# Altium schematic sheet motherboard2.SchDoc
size A
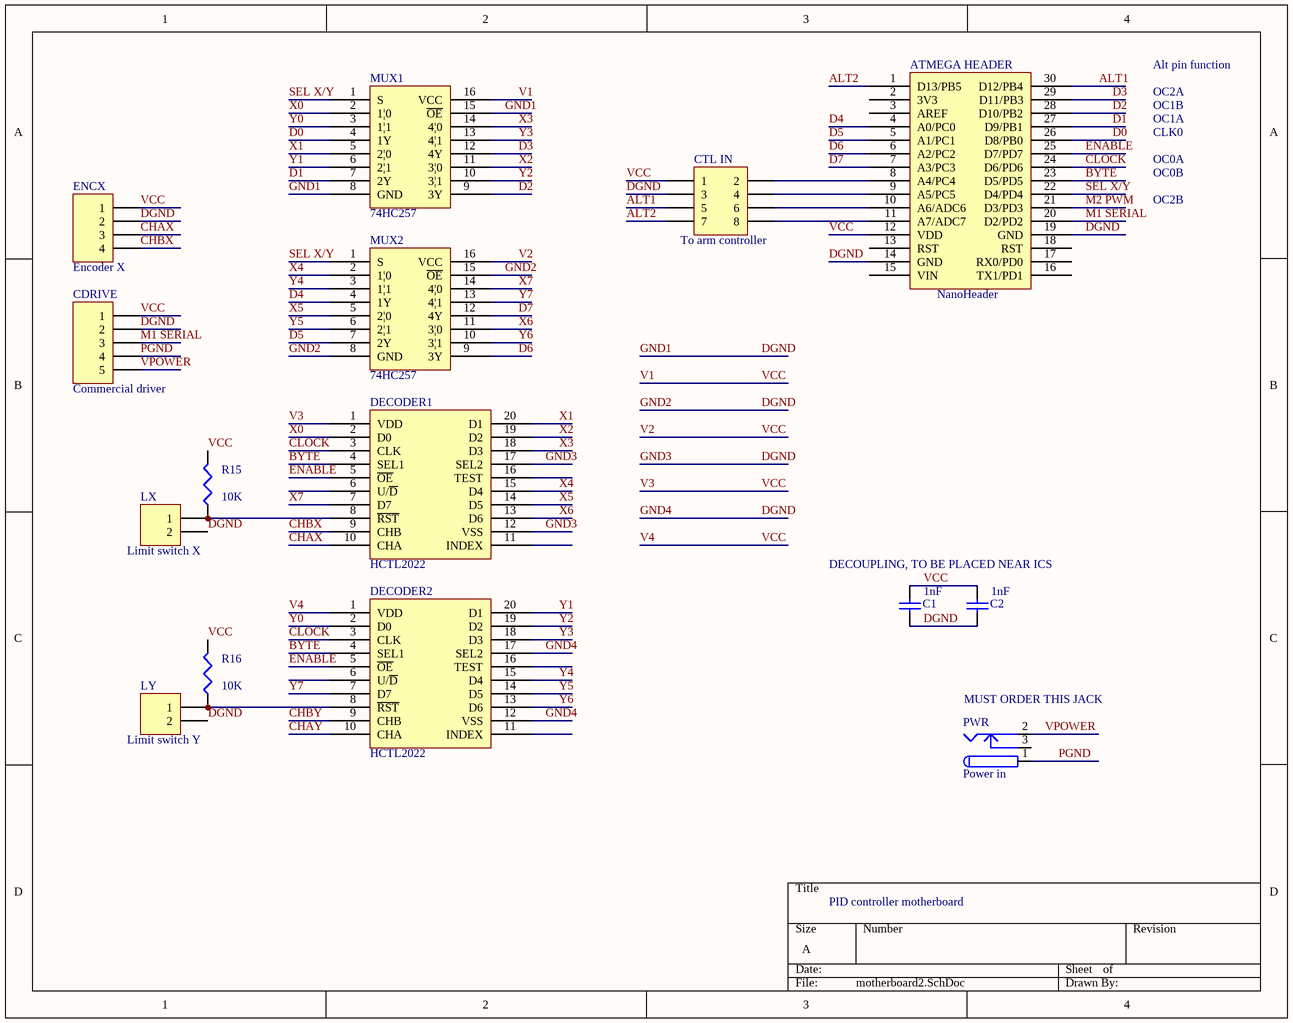
[diagram p0: motherboard2.SchDoc]

## Parts
ATMEGA_HEADER  NanoHeader  [DIP30W]
C1  value 1nF  [RAD-0.3]
C2  value 1nF  [RAD-0.3]
CDRIVE  Commercial driver  [HDR1X5_LGE1.0]
CTL_IN  To arm controller  [HDR2X4_LGE1.0]
DECODER1  HCTL2022  [N020D_LGE1.0]
DECODER2  HCTL2022  [N020D_LGE1.0]
ENCX  Encoder X  [HDR1X4_LGE1.0]
LX  Limit switch X  [HDR1X2_LGE1.0]
LY  Limit switch Y  [HDR1X2_LGE1.0]
MUX1  74HC257  [DIP16_LGE1.0]
MUX2  74HC257  [DIP16_LGE1.0]
PWR  Power in  [KLD_XLGE1.2]
R15  value 10K  [Res10mm_LGE1.0]
R16  value 10K  [Res10mm_LGE1.0]

## Nets
ALT1: ATMEGA_HEADER.30(D12/PB4) CTL_IN.5
ALT2: ATMEGA_HEADER.1(D13/PB5) CTL_IN.7
BYTE: ATMEGA_HEADER.23(D5/PD5) DECODER1.4(SEL1) DECODER2.4(SEL1)
CHAX: DECODER1.10(CHA) ENCX.3
CHAY: DECODER2.10(CHA)
CHBX: DECODER1.9(CHB) ENCX.4
CHBY: DECODER2.9(CHB)
CLOCK: ATMEGA_HEADER.24(D6/PD6) DECODER1.3(CLK) DECODER2.3(CLK)
D0: ATMEGA_HEADER.26(D8/PB0) MUX1.4(1Y)
D1: ATMEGA_HEADER.27(D9/PB1) MUX1.7(2Y)
D2: ATMEGA_HEADER.28(D10/PB2) MUX1.9(3Y)
D3: ATMEGA_HEADER.29(D11/PB3) MUX1.12(4Y)
D4: ATMEGA_HEADER.4(A0/PC0) MUX2.4(1Y)
D5: ATMEGA_HEADER.5(A1/PC1) MUX2.7(2Y)
D6: ATMEGA_HEADER.6(A2/PC2) MUX2.9(3Y)
D7: ATMEGA_HEADER.7(A3/PC3) MUX2.12(4Y)
DGND: ATMEGA_HEADER.14(GND) ATMEGA_HEADER.19(GND) C1.1 C2.1 CDRIVE.2 CTL_IN.3 DECODER1.12(VSS) DECODER1.17(SEL2) DECODER2.12(VSS) DECODER2.17(SEL2) ENCX.2 LX.2 LY.2 MUX1.8(GND) MUX1.15(~{OE}) MUX2.8(GND) MUX2.15(~{OE})  [also labelled GND1, GND2, GND3, GND4]
ENABLE: ATMEGA_HEADER.25(D7/PD7) DECODER1.5(~{OE}) DECODER2.5(~{OE})
M1 SERIAL: ATMEGA_HEADER.20(D2/PD2) CDRIVE.3
M2 PWM: ATMEGA_HEADER.21(D3/PD3)
PGND: CDRIVE.4 PWR.1
SEL X/Y: ATMEGA_HEADER.22(D4/PD4) MUX1.1(S) MUX2.1(S)
V1: ATMEGA_HEADER.12(VDD) C1.2 C2.2 CDRIVE.1 CTL_IN.1 DECODER1.1(VDD) DECODER2.1(VDD) ENCX.1 MUX1.16(VCC) MUX2.16(VCC) R15.2 R16.2  [also labelled V2, V3, V4, VCC]
VPOWER: CDRIVE.5 PWR.2
X0: DECODER1.2(D0) MUX1.2(1|0)
X1: DECODER1.20(D1) MUX1.5(2|0)
X2: DECODER1.19(D2) MUX1.11(3|0)
X3: DECODER1.18(D3) MUX1.14(4|0)
X4: DECODER1.15(D4) MUX2.2(1|0)
X5: DECODER1.14(D5) MUX2.5(2|0)
X6: DECODER1.13(D6) MUX2.11(3|0)
X7: DECODER1.7(D7) MUX2.14(4|0)
Y0: DECODER2.2(D0) MUX1.3(1|1)
Y1: DECODER2.20(D1) MUX1.6(2|1)
Y2: DECODER2.19(D2) MUX1.10(3|1)
Y3: DECODER2.18(D3) MUX1.13(4|1)
Y4: DECODER2.15(D4) MUX2.3(1|1)
Y5: DECODER2.14(D5) MUX2.6(2|1)
Y6: DECODER2.13(D6) MUX2.10(3|1)
Y7: DECODER2.7(D7) MUX2.13(4|1)
NetATMEGA_HEADER_8: ATMEGA_HEADER.8(A4/PC4) CTL_IN.2
NetATMEGA_HEADER_9: ATMEGA_HEADER.9(A5/PC5) CTL_IN.4
NetATMEGA_HEADER_10: ATMEGA_HEADER.10(A6/ADC6) CTL_IN.6
NetATMEGA_HEADER_11: ATMEGA_HEADER.11(A7/ADC7) CTL_IN.8
NetDECODER1_8: DECODER1.8(~{RST}) LX.1 R15.1
NetDECODER2_8: DECODER2.8(~{RST}) LY.1 R16.1

Not connected (* = marked no-connect by the designer): ATMEGA_HEADER 2(3V3) 3(AREF) 13(RST) 15(VIN) 16(TX1/PD1) 17(RX0/PD0) 18(RST); DECODER1 6(U/~{D}) 11(INDEX) 16(TEST); DECODER2 6(U/~{D}) 11(INDEX) 16(TEST); PWR 3

## Notes on the sheet
- OC2A
- Alt pin function
- OC0A
- CLK0
- OC1A
- OC1B
- OC0B
- OC2B
- DECOUPLING, TO BE PLACED NEAR ICS
- (near PWR) MUST ORDER THIS JACK
- PID controller motherboard

## Library data of the parts
C1 C2 = Cap: Capacitor; Published: 8-Jun-2000; LatestRevisionDate: 17-Jul-2002; LatestRevisionNote: Re-released for DXP Platform.; PackageReference: RAD-0.3; Publisher: Altium Limited; PackageDescription: Radial Cap, Thru-Hole; 2 Leads; 0.3 in Pin Spacing
CDRIVE = C-Hdr1x5: Header, 6-Pin; LatestRevisionDate: 17-Jul-2002; LatestRevisionNote: Re-released for DXP Platform.; Publisher: Altium Limited
CTL_IN = C-Hdr2x4: Header, 4-Pin, Dual row; LatestRevisionDate: 17-Jul-2002; LatestRevisionNote: Re-released for DXP Platform.; Publisher: Altium Limited
ENCX = C-Hdr1x4: Header, 4-Pin; LatestRevisionDate: 17-Jul-2002; LatestRevisionNote: Re-released for DXP Platform.; Publisher: Altium Limited
LX LY = C-Hdr1x2: Header, 2-Pin; LatestRevisionDate: 17-Jul-2002; LatestRevisionNote: Re-released for DXP Platform.; Publisher: Altium Limited
PWR = Power in: Low Voltage Power Supply Connector; Published: 17-Dec-2003; DatasheetDocument: 09-May-2002; Publisher: Altium Limited; ComponentLink1Description: Manufacturer Link; ComponentLink1URL: http://domino.kycon.com/internet/Products.html
R15 R16 = G-Res: resistor (specify value); Published: 8-Jun-2000; LatestRevisionDate: 29-May-2009; LatestRevisionNote: IPC-7351 Footprint Added.; PackageReference: J1-0603; Publisher: Altium Limited; PackageDescription: Chip Resistor